# Altium schematic sheet RK809-5.schdoc: =
size A3; Symbol: Sheet-Symbol_A4; Company: 嘉立创EDA; Version: V1.0; Page Size: A4; @Project Name: RK3568B2地瓜派; @Page Count: 27; @Update Date: 2025-09-11; @Create Date: 2025-09-11; @Schematic Name: Schematic1; @Page No: 14; @Page Name: RK809-5; Device: Sheet-Symbol_A4; Border: 1; Title Block Position: 3; Width: 1655; Height: 1170; Region Start: 1; X Region Count: 6; Y Region Count: 4; Blade Width: 10; @Board Name: Board1; @Create Time: 22:14:45; @Update Time: 22:15:05; Organization: ORGANIZATION; Address1: ADDRESS 1; Address2: ADDRESS 2; Address3: ADDRESS 3; Address4: ADDRESS 4; SheetNumber: 6; SheetTotal: 28
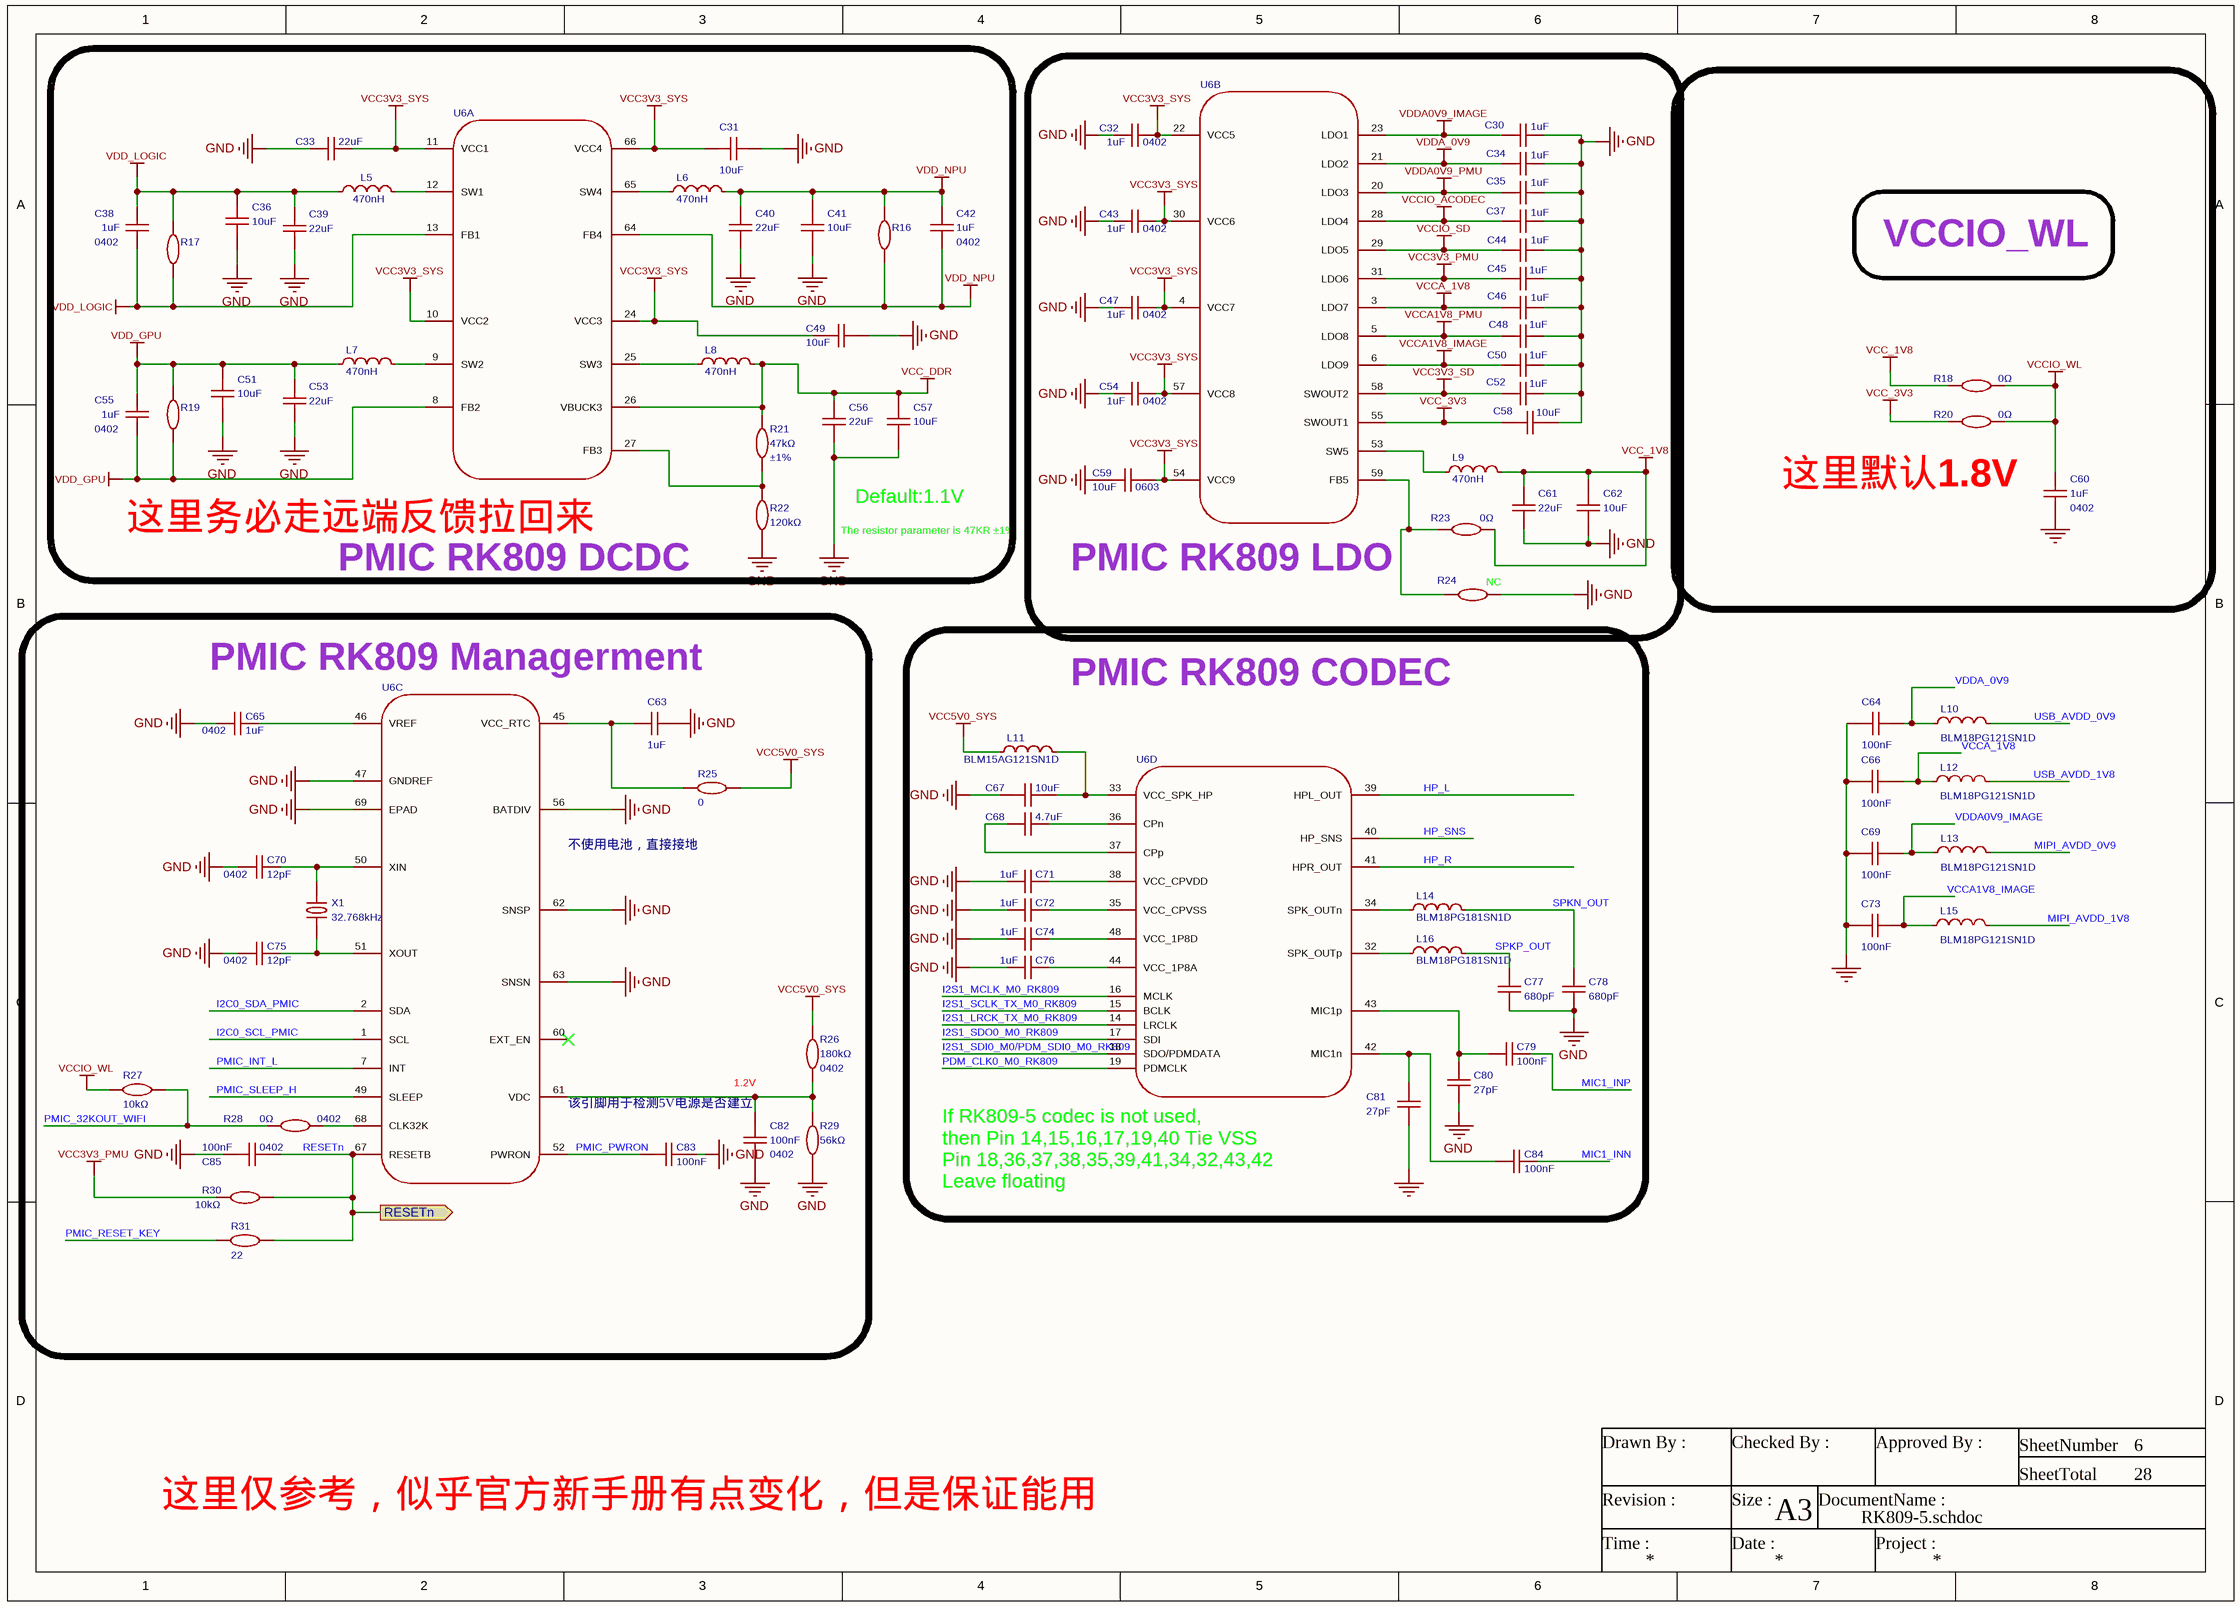
[diagram p0: RK809-5.schdoc]

## Parts
C30  1uF  [MYC0402]
C31  10uF  [C0603]
C32  1uF  Supplier Footprint: 0402  [MYC0402]
C33  22uF  [C0603]
C34  1uF  [MYC0402]
C35  1uF  [MYC0402]
C36  10uF  [C0603]
C37  1uF  [MYC0402]
C38  1uF  Supplier Footprint: 0402  [MYC0402]
C39  22uF  [C0603]
C40  22uF  [C0603]
C41  10uF  [C0603]
C42  1uF  Supplier Footprint: 0402  [MYC0402]
C43  1uF  Supplier Footprint: 0402  [MYC0402]
C44  1uF  [MYC0402]
C45  1uF  [MYC0402]
C46  1uF  [MYC0402]
C47  1uF  Supplier Footprint: 0402  [MYC0402]
C48  1uF  [MYC0402]
C49  10uF  [C0603]
C50  1uF  [MYC0402]
C51  10uF  [C0603]
C52  1uF  [MYC0402]
C53  22uF  [C0603]
C54  1uF  Supplier Footprint: 0402  [MYC0402]
C55  1uF  Supplier Footprint: 0402  [MYC0402]
C56  22uF  [C0603]
C57  10uF  [C0603]
C58  10uF  [C0603]
C59  10uF  Supplier Footprint: 0603  [C0603]
C60  1uF  Supplier Footprint: 0402  [MYC0402]
C61  22uF  [C0603]
C62  10uF  [C0603]
C63  1uF  [MYC0402]
C64  100nF  [MYC0402]
C65  1uF  Supplier Footprint: 0402  [MYC0402]
C66  100nF  [MYC0402]
C67  10uF  [MYC0402]
C68  4.7uF  [MYC0402]
C69  100nF  [MYC0402]
C70  12pF  Supplier Footprint: 0402  [MYC0402]
C71  1uF  [MYC0402]
C72  1uF  [MYC0402]
C73  100nF  [MYC0402]
C74  1uF  [MYC0402]
C75  12pF  Supplier Footprint: 0402  [MYC0402]
C76  1uF  [MYC0402]
C77  680pF  [R0402]
C78  680pF  [R0402]
C79  100nF  [MYC0402]
C80  27pF  [R0402]
C81  27pF  [R0402]
C82  100nF  Supplier Footprint: 0402  [MYC0402]
C83  100nF  [MYC0402]
C84  100nF  [MYC0402]
C85  100nF  Supplier Footprint: 0402  [MYC0402]
L5  470nH  [IND-SMD_L2.0-W1.6_MHCHL201610A-1R0M-Q8A]
L6  470nH  [IND-SMD_L2.0-W1.6_MHCHL201610A-1R0M-Q8A]
L7  470nH  [IND-SMD_L2.0-W1.6_MHCHL201610A-1R0M-Q8A]
L8  470nH  [IND-SMD_L2.0-W1.6_MHCHL201610A-1R0M-Q8A]
L9  470nH  [IND-SMD_L2.0-W1.6_MHCHL201610A-1R0M-Q8A]
L10  BLM18PG121SN1D  [L0603]
L11  BLM15AG121SN1D  [L0402]
L12  BLM18PG121SN1D  [L0603]
L13  BLM18PG121SN1D  [L0603]
L14  BLM18PG181SN1D  [L0603]
L15  BLM18PG121SN1D  [L0603]
L16  BLM18PG181SN1D  [L0603]
R16  0402WGF1000TCE  [R0402]  (value not drawn)
R17  0402WGF1000TCE  [R0402]  (value not drawn)
R18  0Ω  [R0402]
R19  0402WGF1000TCE  [R0402]  (value not drawn)
R20  0Ω  [R0402]  (no BOM)
R21  47kΩ  Tolerance: ±1%  [R0402]
R22  120kΩ  [R0402]
R23  0Ω  [R0402]
R24  NC  [R0402]  (no BOM)
R25  0  [R0402]
R26  180kΩ  Supplier Footprint: 0402  [R0402]
R27  10kΩ  [R0402]
R28  0Ω  Supplier Footprint: 0402  [R0402]
R29  56kΩ  [R0402]
R30  10kΩ  [R0402]
R31  22  [R0402]
U6  (no value)  [RK809-5]  (parts A,B,C,D of 4)
X1  32.768kHz  [CRYSTAL-SMD_L3.2-W1.5-1]

## Blocks framed on the sheet
PMIC RK809 LDO: C30 C32 C34 C35 C37 C43-C48 C50 C52 C54 C58 C59 C61 C62 L9 R23 R24 U6
PMIC RK809 Managerment: C63 C65 C70 C75 C82 C83 C85 R25-R31 U6 X1
PMIC RK809 CODEC: C67 C68 C71 C72 C74 C76-C81 C84 L11 L14 L16 U6

## Ports
RESETn (out)

## Nets
GND: C30.2 C31.2 C32.1 C33.1 C34.2 C35.2 C36.1 C37.2 C39.2 C40.2 C41.1 C43.1 C44.2 C45.2 C46.2 C47.1 C48.2 C49.1 C50.2 C51.1 C52.2 C53.2 C54.1 C56.2 C57.1 C58.2 C59.1 C60.1 C61.2 C62.1 C63.2 C64.1 C65.1 C66.1 C67.1 C69.1 C70.1 C71.1 C72.1 C73.1 C74.1 C75.2 C76.1 C77.1 C78.1 C80.1 C81.1 C82.1 C83.2 C85.1 R22.1 R24.2 R29.1 U6.47(GNDREF) U6.56(BATDIV) U6.62(SNSP) U6.63(SNSN) U6.69(EPAD)
VCC3V3_PMU: C45.1 R30.1 U6.31(LDO6)
VCC3V3_SD: C52.1 U6.58(SWOUT2)
VCC3V3_SYS: C31.1 C32.2 C33.2 C43.2 C47.2 C49.2 C54.2 C59.2 U6.4(VCC7) U6.10(VCC2) U6.11(VCC1) U6.22(VCC5) U6.24(VCC3) U6.30(VCC6) U6.54(VCC9) U6.57(VCC8) U6.66(VCC4)
VCC5V0_SYS: L11.1 R25.2 R26.2
VCC_1V8: C61.1 C62.2 L9.2 R18.1 R23.2
VCC_3V3: C58.1 R20.1 U6.55(SWOUT1)
VCC_DDR: C56.1 C57.2 L8.2 R21.1 U6.26(VBUCK3)
VCCA1V8_IMAGE: C50.1 C73.2 L15.1 U6.6(LDO9)
VCCA1V8_PMU: C48.1 U6.5(LDO8)
VCCA_1V8: C46.1 C66.2 L12.1 U6.3(LDO7)
VCCIO_ACODEC: C37.1 U6.28(LDO4)
VCCIO_SD: C44.1 U6.29(LDO5)
VCCIO_WL: C60.2 R18.2 R20.2 R27.1
VDD_GPU: C51.2 C53.1 C55.1 C55.2 L7.1 R19.1 R19.2 U6.8(FB2)
VDD_LOGIC: C36.2 C38.1 C38.2 C39.1 L5.1 R17.1 R17.2 U6.13(FB1)
VDD_NPU: C40.1 C41.2 C42.1 C42.2 L6.2 R16.1 R16.2 U6.64(FB4)
VDDA0V9_IMAGE: C30.1 C69.2 L13.1 U6.23(LDO1)
VDDA0V9_PMU: C35.1 U6.20(LDO3)
VDDA_0V9: C34.1 C64.2 L10.1 U6.21(LDO2)
HP_L: U6.39(HPL_OUT)
HP_R: U6.41(HPR_OUT)
HP_SNS: U6.40(HP_SNS)
I2C0_SCL_PMIC: U6.1(SCL)
I2C0_SDA_PMIC: U6.2(SDA)
I2S1_LRCK_TX_M0_RK809: U6.14(LRCLK)
I2S1_MCLK_M0_RK809: U6.16(MCLK)
I2S1_SCLK_TX_M0_RK809: U6.15(BCLK)
I2S1_SDI0_M0/PDM_SDI0_M0_RK809: U6.18(SDO/PDMDATA)
I2S1_SDO0_M0_RK809: U6.17(SDI)
MIC1_INN: C84.2
MIC1_INP: C79.2
MIPI_AVDD_0V9: L13.2
MIPI_AVDD_1V8: L15.2
PDM_CLK0_M0_RK809: U6.19(PDMCLK)
PMIC_32KOUT_WIFI: R27.2 R28.1
PMIC_INT_L: U6.7(INT)
PMIC_PWRON: C83.1 U6.52(PWRON)
PMIC_RESET_KEY: R31.1
PMIC_SLEEP_H: U6.49(SLEEP)
RESETn: C85.2 R30.2 R31.2 U6.67(RESETB) ; port RESETn
SPKN_OUT: C78.2 L14.2
SPKP_OUT: C77.2 L16.2
USB_AVDD_0V9: L10.2
USB_AVDD_1V8: L12.2
NetC63_1: C63.1 R25.1 U6.45(VCC_RTC)
NetC65_2: C65.2 U6.46(VREF)
NetC67_2: C67.2 L11.2 U6.33(VCC_SPK_HP)
NetC68_1: C68.1 U6.36(CPn)
NetC68_2: C68.2 U6.37(CPp)
NetC70_2: C70.2 U6.50(XIN) X1.2
NetC71_2: C71.2 U6.38(VCC_CPVDD)
NetC72_2: C72.2 U6.35(VCC_CPVSS)
NetC74_2: C74.2 U6.48(VCC_1P8D)
NetC75_1: C75.1 U6.51(XOUT) X1.1
NetC76_2: C76.2 U6.44(VCC_1P8A)
NetC79_1: C79.1 C80.2 U6.43(MIC1p)
NetC81_2: C81.2 C84.1 U6.42(MIC1n)
NetC82_2: C82.2 R26.1 R29.2 U6.61(VDC)
NetL5_2: L5.2 U6.12(SW1)
NetL6_1: L6.1 U6.65(SW4)
NetL7_2: L7.2 U6.9(SW2)
NetL8_1: L8.1 U6.25(SW3)
NetL9_1: L9.1 U6.53(SW5)
NetL14_1: L14.1 U6.34(SPK_OUTn)
NetL16_1: L16.1 U6.32(SPK_OUTp)
NetR21_2: R21.2 R22.2 U6.27(FB3)
NetR23_1: R23.1 R24.1 U6.59(FB5)
NetR28_2: R28.2 U6.68(CLK32K)

Not connected (* = marked no-connect by the designer): U6 60(EXT_EN)*

## Notes on the sheet
- VCCIO_WL
- 这里默认1.8V
- (near U6) 这里务必走远端反馈拉回来
- The resistor parameter is 47KR ±1%
- Default:1.1V
- PMIC RK809 DCDC
- (near U6) 不使用电池，直接接地
- 该引脚用于检测5V电源是否建立
- (near C82) 1.2V
- If RK809-5 codec is not used,
  then Pin 14,15,16,17,19,40 Tie VSS
  Pin 18,36,37,38,35,39,41,34,32,43,42
  Leave floating
- 这里仅参考，似乎官方新手册有点变化，但是保证能用
- Drawn By :
- Checked By :
- Approved By :
- SheetNumber
- SheetTotal
- Revision :
- Time :
- Size :
- Date :
- A3
- DocumentName :
- Project :

## Library data of the parts
C30 C32 C34 C35 C37 C38 C42-C48 C50 C52 C54 C55 C60 C63 C65 C71 C72 C74 C76 = CL05A105KP5NNNC: 容值:1uF;精度:±10%;额定电压:10V;材质(温度系数):X5R;; Manufacturer: SAMSUNG(三星); AddInBom: yes; ModelId: 36a51122f27c49738f86b3bfa98863e0; ModelName: C0402_L1.0-W0.5-H0.5; ModelTransform: 39.37,19.685,0,0,0,0,0,0,0; Tolerance: ±10%; Voltage Rated: 10V; Temperature Coefficient: X5R; Device: CL05A105KP5NNNC; Symbol: CL05A105KP5NNNC; LCSC Part Name: 1uF ±10% 10V; SupplierPart: C14445; ManufacturerPart: CL05A105KP5NNNC; JLCPCB Part Class: 扩展库; Datasheet: https://atta.szlcsc.com/upload/public/pdf/source/20160103/1457707670698.pdf; Supplier: LCSC; ConvertToPcb: yes; FootprintName: MYC0402; Value: 1uF
  C30 C34 C35 C37 C44-C46 C48 C50 C52 C63 C71 C72 C74 C76: Supplier Footprint: 0402
C31 = CAP_0603: Symbol: Capacitance; ConvertToPcb: yes; ModelId: ac125912035d415993ca9572d50418b1聨0819f05c4eef4c71ace90d822a990e87; ModelName: C0603_L1.6-W0.8-H0.8; ModelTransform: 62.992,31.496,0,0,0,0,0,0,0; Device: CAP_0603; Value: 10uF; AddInBom: yes; Supplier Footprint: 0603; FootprintName: C0603
C33 C39 C40 C53 C56 C61 = CL10A226MQ8NRNC: 容值:22uF;精度:±20%;额定电压:6.3V;材质(温度系数):X5R;; Manufacturer: SAMSUNG(三星); Symbol: GRT188R61A226ME13D; AddInBom: yes; ModelId: ac125912035d415993ca9572d50418b1; ModelName: C0603_L1.6-W0.8-H0.8; ModelTransform: 62.992,31.496,0,0,0,0,0,0,0; Tolerance: ±20%; Voltage Rated: 6.3V; Temperature Coefficient: X5R; Supplier Footprint: 0603; Device: CL10A226MQ8NRNC; LCSC Part Name: 22uF ±20% 6.3V; SupplierPart: C59461; ManufacturerPart: CL10A226MQ8NRNC; JLCPCB Part Class: Basic Part; Datasheet: https://atta.szlcsc.com/upload/public/pdf/source/20160218/1457707763339.pdf; Supplier: LCSC; ConvertToPcb: yes; FootprintName: C0603; Value: 22uF
C36 C41 C49 C51 C57-C59 C62 = CL10A106KP8NNNC: 容值:10uF;精度:±10%;额定电压:10V;材质(温度系数):X5R;; Manufacturer: SAMSUNG(三星); Symbol: 0603X106M100; AddInBom: yes; ModelId: ac125912035d415993ca9572d50418b1; ModelName: C0603_L1.6-W0.8-H0.8; ModelTransform: 62.992,31.496,0,0,0,0,0,0,0; Tolerance: ±10%; Voltage Rated: 10V; Temperature Coefficient: X5R; Device: CL10A106KP8NNNC; LCSC Part Name: 10uF ±10% 10V; SupplierPart: C19702; ManufacturerPart: CL10A106KP8NNNC; JLCPCB Part Class: Basic Part; Datasheet: https://atta.szlcsc.com/upload/public/pdf/source/20160103/1457707703378.pdf; Supplier: LCSC; ConvertToPcb: yes; FootprintName: C0603; Value: 10uF
  C36 C41 C49 C51 C57 C58 C62: Supplier Footprint: 0603
C64 C66 C69 C73 = CAP_0402: Symbol: CapAcitance; ConvertToPcb: yes; ModelId: 36a51122f27c49738f86b3bfa98863e0; ModelName: C0402_L1.0-W0.5-H0.5; ModelTransform: 39.37,19.685,0,0,0,0,0,0,0; Device: CAP_0402; AddInBom: yes; Supplier Footprint: 0402; FootprintName: MYC0402; Value: 100nF
C67 = CL05A106MQ5NUNC: 容值:10uF;精度:±20%;额定电压:6.3V;材质(温度系数):X5R;; Manufacturer: SAMSUNG(三星); Symbol: 0603X106M100; AddInBom: yes; ModelId: 36a51122f27c49738f86b3bfa98863e0; ModelName: C0402_L1.0-W0.5-H0.5; ModelTransform: 39.37,19.685,0,0,0,0,0,0,0; Tolerance: ±20%; Voltage Rated: 6.3V; Temperature Coefficient: X5R; JLCPCB Part Class: Basic Part; Device: CL05A106MQ5NUNC; LCSC Part Name: 10uF ±20% 6.3V; SupplierPart: C15525; ManufacturerPart: CL05A106MQ5NUNC; Supplier Footprint: 0402; Datasheet: https://atta.szlcsc.com/upload/public/pdf/source/20220823/2B02EE04F8F211D38A52DCB16EB6BEBA.pdf; Supplier: LCSC; ConvertToPcb: yes; FootprintName: MYC0402; Value: 10uF
C68 = CL05A475MQ5NRNC: 容值:4.7uF;精度:±20%;额定电压:6.3V;材质(温度系数):X5R;; Manufacturer: SAMSUNG(三星); Symbol: CL10A475KO8NNNC; AddInBom: yes; ModelId: 36a51122f27c49738f86b3bfa98863e0; ModelName: C0402_L1.0-W0.5-H0.5; ModelTransform: 39.37,19.685,0,0,0,0,0,0,0; Tolerance: ±20%; Voltage Rated: 6.3V; Temperature Coefficient: X5R; Device: CL05A475MQ5NRNC; LCSC Part Name: 4.7uF ±20% 6.3V; SupplierPart: C307423; ManufacturerPart: CL05A475MQ5NRNC; Supplier Footprint: 0402; JLCPCB Part Class: Extended Part; Datasheet: https://atta.szlcsc.com/upload/public/pdf/source/20181010/C307423_0E0C4E35F3A09F81C2E5C84E00499E42.pdf; Supplier: LCSC; ConvertToPcb: yes; FootprintName: MYC0402; Value: 4.7uF
C70 C75 = 0402CG120J500NT: 容值:12pF;精度:±5%;额定电压:50V;材质(温度系数):C0G;; Manufacturer: FH(风华); Symbol: 0402CG220J500NT; AddInBom: yes; ModelId: 36a51122f27c49738f86b3bfa98863e0; ModelName: C0402_L1.0-W0.5-H0.5; ModelTransform: 39.37,19.685,0,0,0,0,0,0,0; Tolerance: ±5%; Voltage Rated: 50V; Temperature Coefficient: C0G; Datasheet: https://atta.szlcsc.com/upload/public/pdf/source/20200305/C486355_26A10D38EF8C2A5C37091D0039909270.pdf; Device: 0402CG120J500NT; LCSC Part Name: 12pF ±5% 50V; SupplierPart: C1547; ManufacturerPart: 0402CG120J500NT; JLCPCB Part Class: Basic Part; Supplier: LCSC; ConvertToPcb: yes; FootprintName: MYC0402; Value: 12pF
C77 C78 = 0402B681K500NT: 容值:680pF;精度:±10%;额定电压:50V;材质(温度系数):X7R;; Manufacturer: FH(风华); AddInBom: yes; ModelId: 36a51122f27c49738f86b3bfa98863e0; ModelName: C0402_L1.0-W0.5-H0.5; ModelTransform: 39.37,19.685,0,0,0,0,0,0,0; Tolerance: ±10%; Voltage Rated: 50V; Temperature Coefficient: X7R; Device: 0402B681K500NT; Symbol: 0402B681K500NT; LCSC Part Name: 680pF ±10% 50V; SupplierPart: C1541; ManufacturerPart: 0402B681K500NT; Supplier Footprint: 0402; JLCPCB Part Class: Extended Part; Datasheet: https://atta.szlcsc.com/upload/public/pdf/source/20170923/C1541_1506149263051988348.pdf; Supplier: LCSC; ConvertToPcb: yes; FootprintName: R0402; Value: 680pF
C79 C84 = CL05B104KO5NNNC: 容值:100nF;精度:±10%;额定电压:16V;材质(温度系数):X7R;; Manufacturer: SAMSUNG(三星); AddInBom: yes; ModelId: 36a51122f27c49738f86b3bfa98863e0; ModelName: C0402_L1.0-W0.5-H0.5; ModelTransform: 39.37,19.685,0,0,0,0,0,0,0; Tolerance: ±10%; Voltage Rated: 16V; Temperature Coefficient: X7R; Device: CL05B104KO5NNNC; Symbol: CL05B104KO5NNNC; LCSC Part Name: 100nF ±10% 16V; SupplierPart: C1525; ManufacturerPart: CL05B104KO5NNNC; Supplier Footprint: 0402; JLCPCB Part Class: 基础库; Datasheet: https://atta.szlcsc.com/upload/public/pdf/source/20160103/1457707674891.pdf; Supplier: LCSC; ConvertToPcb: yes; FootprintName: MYC0402; Value: 100nF
C80 C81 = 0402CG270J500NT: 容值:27pF;精度:±5%;额定电压:50V;材质(温度系数):C0G;; Manufacturer: FH(风华); Symbol: 0402CG270J500NTN; AddInBom: yes; ModelId: 36a51122f27c49738f86b3bfa98863e0; ModelName: C0402_L1.0-W0.5-H0.5; ModelTransform: 39.37,19.685,0,0,0,0,0,0,0; Tolerance: ±5%; Voltage Rated: 50V; Temperature Coefficient: C0G; Device: 0402CG270J500NT; LCSC Part Name: 27pF ±5% 50V; SupplierPart: C1557; ManufacturerPart: 0402CG270J500NT; Supplier Footprint: 0402; JLCPCB Part Class: Basic Part; Datasheet: https://atta.szlcsc.com/upload/public/pdf/source/20170923/C1557_1506149270123988364.pdf; Supplier: LCSC; ConvertToPcb: yes; FootprintName: R0402; Value: 27pF
C82 C83 C85 = CL05B104KB54PNC: 容值:100nF;精度:±10%;额定电压:50V;材质(温度系数):X7R;; Manufacturer: SAMSUNG(三星); AddInBom: yes; ModelId: 36a51122f27c49738f86b3bfa98863e0; ModelName: C0402_L1.0-W0.5-H0.5; ModelTransform: 39.37,19.685,0,0,0,0,0,0,0; Tolerance: ±10%; Voltage Rated: 50V; Temperature Coefficient: X7R; Symbol: CL05B104KB54PNC; Device: CL05B104KB54PNC; LCSC Part Name: 100nF ±10% 50V; SupplierPart: C307331; ManufacturerPart: CL05B104KB54PNC; JLCPCB Part Class: Basic Part; Datasheet: https://atta.szlcsc.com/upload/public/pdf/source/20181009/C307331_222F7C870FD3EA5F46F538B483443886.pdf; Supplier: LCSC; ConvertToPcb: yes; FootprintName: MYC0402; Value: 100nF
  C83: Supplier Footprint: 0402
L5-L9 = MCS20FC-R47MHC: 电感值:470nH;精度:±20%;额定电流:4.05A;; Manufacturer: PSA(信昌电陶); AddInBom: yes; ModelId: 668c12c5c4cf45ec81ccaa044c30b915; ModelTransform: 79.527,63.7794,0,0,0,0,0,0,0; Tolerance: ±20%; Rated Current: 4.05A; DC Resistance (DCR): 23mΩ; Device: MCS20FC-R47MHC; Symbol: MCS20FC-R47MHC; LCSC Part Name: 470nH ±20% 4.05A 23mΩ; SupplierPart: C375941; ManufacturerPart: MCS20FC-R47MHC; Supplier Footprint: SMD; JLCPCB Part Class: 扩展库; Datasheet: https://atta.szlcsc.com/upload/public/pdf/source/20190312/C375941_0FA6931C341ECE1823B3912EFF81D587.pdf; Supplier: LCSC; ConvertToPcb: yes; FootprintName: IND-SMD_L2.0-W1.6_MHCHL201610A-1R0M-Q8A; ModelName: IND-SMD_L2.0-W1.6_MHCHL201610A-1R0M-Q8A; Value: 470nH
L10 L12 L13 L15 = BLM18PG121SN1D: 标称阻抗@测试频率:120Ω@100MHz;误差:±25%;直流电阻(RDC):50mΩ;; Manufacturer: muRata(村田); Symbol: BLM18PG121SN1D_C14709; AddInBom: yes; ModelId: 2bc5ec593d464d6ba9807aec0b5673c2; ModelName: L0603_L1.6-W0.8-H0.5_BEAD; ModelTransform: 62.992,31.496,0,180,0,0,0.094,0.629,0; Tolerance: ±25%; DC Resistance: 50mΩ; Current Rating: 2A; Circuits: 1; Device: BLM18PG121SN1D; LCSC Part Name: 单路 0603磁珠 阻抗120Ω@100MHz; SupplierPart: C14709; ManufacturerPart: BLM18PG121SN1D; Supplier Footprint: 0603; JLCPCB Part Class: 基础库; Datasheet: https://atta.szlcsc.com/upload/public/pdf/source/20130704/1457706621422.pdf; Supplier: LCSC; ConvertToPcb: yes; FootprintName: L0603; Impedance @ Frequency: 120Ω@100MHz
L11 = BLM15AG121SN1D: 标称阻抗@测试频率:120Ω@100MHz;误差:±25%;直流电阻(RDC):250mΩ;额定电流:500mA;电路数:1;; Manufacturer: muRata(村田); Symbol: CBM160808U121T; AddInBom: yes; ModelId: d8d36575a3234d4790bfa765c88664a7; ModelName: L0402_L1.0-W0.5-H0.5_BEAD; ModelTransform: 39.37,19.685,0,0,0,0,0,0.0005,0; Tolerance: ±25%; DC Resistance: 250mΩ; Current Rating: 500mA; Circuits: 1; Device: BLM15AG121SN1D; LCSC Part Name: 120Ω@100MHz ±25%; SupplierPart: C85812; ManufacturerPart: BLM15AG121SN1D; Supplier Footprint: 0402; JLCPCB Part Class: Extended Part; Datasheet: https://atta.szlcsc.com/upload/public/pdf/source/20180326/C85812_709B7ABD18A92BCC8FFBD7A231EEE264.pdf; Supplier: LCSC; ConvertToPcb: yes; FootprintName: L0402; Impedance @ Frequency: 120Ω@100MHz
L14 L16 = BLM18PG181SN1D: 标称阻抗@测试频率:180Ω@100MHz;误差:±25%;直流电阻(RDC):90mΩ;额定电流:1.5A;电路数:1;; Manufacturer: muRata(村田); AddInBom: yes; ModelId: 2bc5ec593d464d6ba9807aec0b5673c2; ModelName: L0603_L1.6-W0.8-H0.5_BEAD; ModelTransform: 62.992,31.496,0,180,0,0,0.094,0.629,0; Tolerance: ±25%; DC Resistance: 90mΩ; Current Rating: 1.5A; Circuits: 1; Device: BLM18PG181SN1D; Symbol: BLM18PG181SN1D; LCSC Part Name: 180Ω@100MHz ±25%; SupplierPart: C82850; ManufacturerPart: BLM18PG181SN1D; Supplier Footprint: 0603; JLCPCB Part Class: Extended Part; Datasheet: https://atta.szlcsc.com/upload/public/pdf/source/20180326/C82850_BC876320DC99E3923AFD377E2F9C4AED.pdf; Supplier: LCSC; ConvertToPcb: yes; FootprintName: L0603; Impedance @ Frequency: 180Ω@100MHz
R16 R17 R19 = 0402WGF1000TCE: Manufacturer: UNI-ROYAL(厚声); ConvertToPcb: yes; ModelId: 671aefced39d4c318694bba8bd8efd39; ModelName: R0402_L1.0-W0.5-H0.5; ModelTransform: 39.37,19.685,0,0,0,0,0,0.0005,0; LCSC Part Name: 100Ω(1000) ±1% 编带; Device: 0402WGF1000TCE; Symbol: 0402WGF1000TCE; AddInBom: yes; Supplier: LCSC; SupplierPart: C25076; Supplier Footprint: 0402; JLCPCB Part Class: Basic Part; Datasheet: https://atta.szlcsc.com/upload/public/pdf/source/20170920/C25076_1505901197574982707.pdf; ManufacturerPart: 0402WGF1000TCE; FootprintName: R0402
R18 R23 R28 = ERJ2GE0R00X: 电阻类型:-;阻值:0Ω;功率:100mW;温度系数:-100ppm/℃~+600ppm/℃;最大工作电压:-;工作温度范围:-55℃~+155℃;; Manufacturer: PANASONIC(松下); AddInBom: yes; ModelId: 671aefced39d4c318694bba8bd8efd39; ModelName: R0402_L1.0-W0.5-H0.5; ModelTransform: 39.37,19.685,0,0,0,0,0,0.0005,0; Power(Watts): 100mW; Device: ERJ2GE0R00X; Symbol: ERJ2GE0R00X; LCSC Part Name: 0Ω 100mW; SupplierPart: C242160; ManufacturerPart: ERJ2GE0R00X; JLCPCB Part Class: 扩展库; Datasheet: https://atta.szlcsc.com/upload/public/pdf/source/20181106/C242160_CA6E41971DE5A1DCD79442F3CF334CD6.pdf; Supplier: LCSC; ConvertToPcb: yes; FootprintName: R0402; Type: -; Value: 0Ω; Temperature Coefficient: -100ppm/℃~+600ppm/℃; Overload Voltage (Max): -; Operating Temperature Range: -55℃~+155℃
  R18 R23: Supplier Footprint: 0402
R20 = ERJ2GE0R00X: 电阻类型:-;阻值:0Ω;功率:100mW;温度系数:-100ppm/℃~+600ppm/℃;最大工作电压:-;工作温度范围:-55℃~+155℃;; Manufacturer: PANASONIC(松下); Convert to PCB: yes; Add into BOM: no; ModelId: 671aefced39d4c318694bba8bd8efd39; ModelName: R0402_L1.0-W0.5-H0.5; ModelTransform: 39.37,19.685,0,0,0,0,0,0.0005,0; Power(Watts): 100mW; Device: ERJ2GE0R00X; Symbol: ERJ2GE0R00X; LCSC Part Name: 0Ω 100mW; SupplierPart: C242160; ManufacturerPart: ERJ2GE0R00X; Supplier Footprint: 0402; JLCPCB Part Class: 扩展库; Datasheet: https://atta.szlcsc.com/upload/public/pdf/source/20181106/C242160_CA6E41971DE5A1DCD79442F3CF334CD6.pdf; Supplier: LCSC; FootprintName: R0402; Type: -; Value: 0Ω; Temperature Coefficient: -100ppm/℃~+600ppm/℃; Overload Voltage (Max): -; Operating Temperature Range: -55℃~+155℃
R21 = 0402WGF4702TCE: 电阻类型:厚膜电阻;阻值:47kΩ;精度:±1%;功率:62.5mW;温度系数:±100ppm/℃;最大工作电压:50V;工作温度范围:-55℃~+155℃;; Manufacturer: UNI-ROYAL(厚声); AddInBom: yes; ModelId: 671aefced39d4c318694bba8bd8efd39; ModelName: R0402_L1.0-W0.5-H0.5; ModelTransform: 39.37,19.685,0,0,0,0,0,0.0005,0; Power(Watts): 62.5mW; Overload Voltage (Max): 50V; Device: 0402WGF4702TCE; Symbol: 0402WGF4702TCE; LCSC Part Name: 47kΩ ±1% 62.5mW; SupplierPart: C25792; ManufacturerPart: 0402WGF4702TCE; Supplier Footprint: 0402; JLCPCB Part Class: Basic Part; Datasheet: https://atta.szlcsc.com/upload/public/pdf/source/20200306/C422600_1E6D84923E4A46A82E41ADD87F860B5C.pdf; Supplier: LCSC; ConvertToPcb: yes; FootprintName: R0402; Type: 厚膜电阻; Value: 47kΩ; Temperature Coefficient: ±100ppm/℃; Operating Temperature Range: -55℃~+155℃
R22 = 0402WGF1203TCE: 电阻类型:厚膜电阻;阻值:120kΩ;精度:±1%;功率:62.5mW;温度系数:±100ppm/℃;最大工作电压:50V;工作温度范围:-55℃~+155℃;; Manufacturer: UNI-ROYAL(厚声); AddInBom: yes; ModelId: 671aefced39d4c318694bba8bd8efd39; ModelName: R0402_L1.0-W0.5-H0.5; ModelTransform: 39.37,19.685,0,0,0,0,0,0.0005,0; Tolerance: ±1%; Power(Watts): 62.5mW; Overload Voltage (Max): 50V; Device: 0402WGF1203TCE; Symbol: 0402WGF1203TCE; LCSC Part Name: 120kΩ ±1% 62.5mW; SupplierPart: C25750; ManufacturerPart: 0402WGF1203TCE; Supplier Footprint: 0402; JLCPCB Part Class: Basic Part; Datasheet: https://atta.szlcsc.com/upload/public/pdf/source/20200306/C422600_1E6D84923E4A46A82E41ADD87F860B5C.pdf; Supplier: LCSC; ConvertToPcb: yes; FootprintName: R0402; Type: 厚膜电阻; Value: 120kΩ; Temperature Coefficient: ±100ppm/℃; Operating Temperature Range: -55℃~+155℃
R24 = ERJ2GE0R00X: 电阻类型:-;阻值:0Ω;功率:100mW;温度系数:-100ppm/℃~+600ppm/℃;最大工作电压:-;工作温度范围:-55℃~+155℃;; Manufacturer: PANASONIC(松下); Convert to PCB: no; ModelId: 671aefced39d4c318694bba8bd8efd39; ModelName: R0402_L1.0-W0.5-H0.5; ModelTransform: 39.37,19.685,0,0,0,0,0,0.0005,0; Power(Watts): 100mW; Supplier Part: NC; Value: NC; Device: ERJ2GE0R00X; Add into BOM: no; Symbol: ERJ2GE0R00X; LCSC Part Name: 0Ω 100mW; ManufacturerPart: ERJ2GE0R00X; Supplier Footprint: 0402; JLCPCB Part Class: 扩展库; Datasheet: https://atta.szlcsc.com/upload/public/pdf/source/20181106/C242160_CA6E41971DE5A1DCD79442F3CF334CD6.pdf; Supplier: LCSC; FootprintName: R0402; Type: -; Temperature Coefficient: -100ppm/℃~+600ppm/℃; Overload Voltage (Max): -; Operating Temperature Range: -55℃~+155℃
R25 = Res_0402: Symbol: 电阻; 3D Model: 671aefced39d4c318694bba8bd8efd39; 3D Model Transform: 39.37,19.685,0,0,0,0,0,0.0005,0; ConvertToPcb: yes; ModelName: R0402_L1.0-W0.5-H0.5; Device: Res_0402; Supplier Footprint: 0402; Value: 0; AddInBom: yes; FootprintName: R0402
R26 = RC0402FR-07180KL: 电阻类型:厚膜电阻;阻值:180kΩ;精度:±1%;功率:62.5mW;温度系数:±100ppm/℃;最大工作电压:50V;工作温度范围:-55℃~+155℃;; Manufacturer: YAGEO(国巨); AddInBom: yes; ModelId: 671aefced39d4c318694bba8bd8efd39; ModelName: R0402_L1.0-W0.5-H0.5; ModelTransform: 39.37,19.685,0,0,0,0,0,0.0005,0; Tolerance: ±1%; Power(Watts): 62.5mW; Overload Voltage (Max): 50V; Device: RC0402FR-07180KL; Symbol: RC0402FR-07180KL; LCSC Part Name: 180kΩ ±1% 62.5mW; SupplierPart: C138046; ManufacturerPart: RC0402FR-07180KL; JLCPCB Part Class: Extended Part; Datasheet: https://atta.szlcsc.com/upload/public/pdf/source/20171107/C138046_15100516638711096969.pdf; Supplier: LCSC; ConvertToPcb: yes; FootprintName: R0402; Type: 厚膜电阻; Value: 180kΩ; Temperature Coefficient: ±100ppm/℃; Operating Temperature Range: -55℃~+155℃
R27 R30 = CRCW040210K0FKED: 电阻类型:厚膜电阻;阻值:10kΩ;精度:±1%;功率:63mW;温度系数:±100ppm/K;最大工作电压:50V;工作温度范围:-55℃~+155℃;; Manufacturer: VISHAY(威世); AddInBom: yes; ModelId: 671aefced39d4c318694bba8bd8efd39; ModelName: R0402_L1.0-W0.5-H0.5; ModelTransform: 39.37,19.685,0,0,0,0,0,0.0005,0; Tolerance: ±1%; Power(Watts): 63mW; Overload Voltage (Max): 50V; Device: CRCW040210K0FKED; Symbol: CRCW040210K0FKED; LCSC Part Name: 10kΩ ±1% 63mW; SupplierPart: C71617; ManufacturerPart: CRCW040210K0FKED; Supplier Footprint: 0402; JLCPCB Part Class: 扩展库; Datasheet: https://atta.szlcsc.com/upload/public/pdf/source/20180224/C71617_15194370300791364062.pdf; Supplier: LCSC; ConvertToPcb: yes; FootprintName: R0402; Type: 厚膜电阻; Value: 10kΩ; Temperature Coefficient: ±100ppm/K; Operating Temperature Range: -55℃~+155℃
R29 = 0402WGF5602TCE: 精度:±1%;功率:1/16W;温度系数:±100ppm/℃;阻值:56kΩ;最大工作电压:50V;工作温度范围:-55℃~+155℃;; Manufacturer: UNI-ROYAL(厚声); AddInBom: yes; ModelId: 671aefced39d4c318694bba8bd8efd39; ModelName: R0402_L1.0-W0.5-H0.5; ModelTransform: 39.37,19.685,0,0,0,0,0,0.0005,0; Tolerance: ±1%; Power(Watts): 1/16W; Overload Voltage (Max): 50V; Device: 0402WGF5602TCE; Symbol: 0402WGF5602TCE; LCSC Part Name: 56KΩ ±1%; SupplierPart: C25796; ManufacturerPart: 0402WGF5602TCE; Supplier Footprint: 0402; JLCPCB Part Class: Basic Part; Datasheet: https://atta.szlcsc.com/upload/public/pdf/source/20170920/C25796_1505901547482983369.pdf; Supplier: LCSC; ConvertToPcb: yes; FootprintName: R0402; Temperature Coefficient: ±100ppm/℃; Value: 56kΩ; Operating Temperature Range: -55℃~+155℃
R31 = Res_0402: Symbol: 电阻; ConvertToPcb: yes; ModelId: 671aefced39d4c318694bba8bd8efd39; ModelName: R0402_L1.0-W0.5-H0.5; ModelTransform: 39.37,19.685,0,0,0,0,0,0.0005,0; Value: 22; Device: Res_0402; AddInBom: yes; Supplier Footprint: 0402; FootprintName: R0402
U6 = RK809-5: AddInBom: yes; ModelId: e930c577e1fa4bd28a96171513c1b833聨0819f05c4eef4c71ace90d822a990e87; ModelName: QFN-68_L7.0-W7.0-H0.8-P0.35-BL-EP5.5; ModelTransform: 275.59,275.59,29.527499999999996,0,0,0,-3.93701,-11.81102,0; Device: RK809-5; ConvertToPcb: yes; SymbolName: RK809-5; FootprintName: RK809-5
X1 = XKXGI-SUA-32.768K: 频率:32.768kHz;频率公差:±20ppm;负载电容:12.5pF;; Manufacturer: YXC(扬兴晶振); Equivalent Series Resistance (ESR): 70kΩ; Symbol: FC-135 32.7680KA-A; AddInBom: yes; ModelId: 762d7afc596f4558a373612390f4386d; ModelTransform: 125.984,59.055,0,0,0,0,0,0,0; Crystal Type: 贴片无源晶振; Frequency Tolerance: ±20ppm; Load Capacitance: 12.5pF; Operating Temperature: -40℃~+85℃; Frequency Stability: -; Device: XKXGI-SUA-32.768K; LCSC Part Name: 32.768kHz ±20ppm 12.5pF YST310S; SupplierPart: C5213671; ManufacturerPart: XKXGI-SUA-32.768K; Supplier Footprint: SMD3215-2P; JLCPCB Part Class: Extended Part; Datasheet: https://atta.szlcsc.com/upload/public/pdf/source/20221026/C961783E7D3E186CA8CEB40DFC46D85F.pdf; Supplier: LCSC; ConvertToPcb: yes; FootprintName: CRYSTAL-SMD_L3.2-W1.5-1; ModelName: CRYSTAL-SMD_L3.2-W1.5-1; Value: 32.768kHz